# Altium schematic sheet WifiNode_Blk.SchDoc: Blk
size A4; Author: Matias Pardo Errecarret; Revision: 1; SheetNumber: 1; SheetTotal: 5
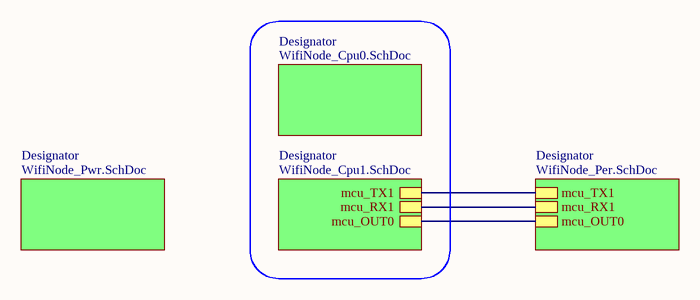
[diagram p0: WifiNode_Blk.SchDoc]

## Sub-sheets
Designator = WifiNode_Cpu0.SchDoc: no entries
Designator = WifiNode_Cpu1.SchDoc: mcu_TX1, mcu_RX1, mcu_OUT0
Designator = WifiNode_Per.SchDoc: mcu_TX1, mcu_RX1, mcu_OUT0
Designator = WifiNode_Pwr.SchDoc: no entries

## Nets
(unnamed): sheet Designator/mcu_TX1, sheet Designator/mcu_TX1
(unnamed): sheet Designator/mcu_RX1, sheet Designator/mcu_RX1
(unnamed): sheet Designator/mcu_OUT0, sheet Designator/mcu_OUT0

## Notes on the sheet
- Title:
- Size:
- Author:
- A4
- Sheet
- of
- Revision:
- File:
- Date: